# Altium schematic sheet LINE_SENSOR.SchDoc
size A; SheetNumber: 4; SheetTotal: 8
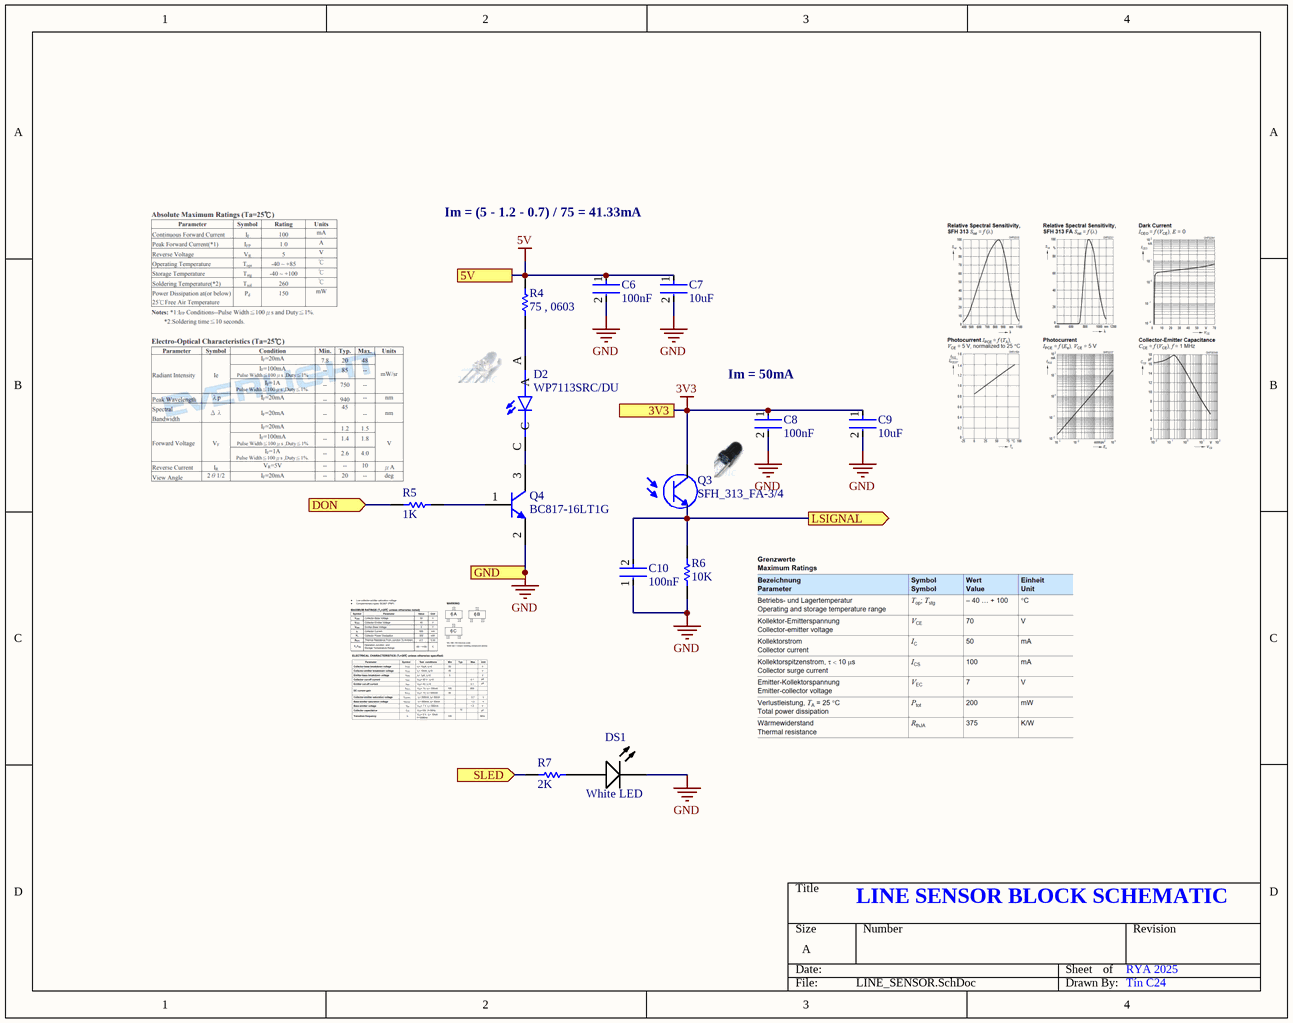
[diagram p0: LINE_SENSOR.SchDoc]

## Parts
C6  100nF  [FP-C0603C-CF-MFG]
C7  10uF  [FP-C0603C-CF-MFG]
C8  100nF  [FP-C0603C-CF-MFG]
C9  10uF  [FP-C0603C-CF-MFG]
C10  100nF  [FP-GRM15-MFG]
D2  WP7113SRC/DU  [IR_LED_NOTBENDED]
DS1  White LED  [AVAG-HSMW-C191_V]
Q3  SFH_313_FA-3/4  [PHOTODIODE_NOTBENDED]
Q4  BC817-16LT1G  [ONSC-SOT-23-3-318-08_V]
R4  75 , 0603  [RESC1608X55X25LL10T15]
R5  1K  [RESC1005X40X25LL05T05]
R6  10K  [RESC1005X40X25LL05T05]
R7  2K  [RESC1005X40X25LL05T05]

## Ports
3V3 (see MAIN_SENSOR[1B], DIS_SENSOR[3B]), 5V (see MAIN_SENSOR[1B], DIS_SENSOR[2B]), DON (in, see MAIN_SENSOR[2B]), GND (see MAIN_SENSOR[1B], DIS_SENSOR[2C]), LSIGNAL (out, see MAIN_SENSOR[2B]), SLED (in, see MAIN_SENSOR[2B])

## Nets
3V3: C8.1 C9.1 Q3.2(C) ; port 3V3
5V: C6.1 C7.1 R4.2 ; port 5V
GND: C6.2 C7.2 C8.2 C9.2 C10.1 DS1.2(K) Q4.2(E) R6.2 ; port GND
DON: R5.2 ; port DON
LSIGNAL: C10.2 Q3.1(E) R6.1 ; port LSIGNAL
SLED: R7.1 ; port SLED
NetD2_A: D2.A R4.1
NetD2_C: D2.C Q4.3(C)
NetDS1_1: DS1.1(A) R7.2
NetQ4_1: Q4.1(B) R5.1

## Notes on the sheet
- Im = (5 - 1.2 - 0.7) / 75 = 41.33mA
- (near C8) Im = 50mA
- LINE SENSOR BLOCK SCHEMATIC
- RYA 2025
- Tín C24

## Library data of the parts
C6-C9 = CMP-1035-00783-3: CAP CER 20PF 50V 5% NP0 0603; Manufacturer Part Number: C0603C200J5GACTU; Manufacturer: KEMET; Temperature Coefficient: 30ppm/°C; Temperature Characteristic: C0G; Automotive Grade: Grade 1; Tolerance: 0.05; Material: Ceramic; Category: Cap; Temperature Range Low: -55°C; RoHS: TRUE; ComponentLink2URL: https://api.kemet.com/component-edge/download/datasheet/C0603C100J5GACAUTO.pdf; Package: C0603C-CF; Height: 0.87mm; Capacitance: 20 pF; Voltage Rating: 50 V; Octopart: https://octopart.com/c0603c200j5gactu-kemet-9138585; Device Class L1: Passive Components; Automotive: Yes; Digikey Description: CAP CER 20PF 50V 5% NP0 0603; Temperature Range High: +125°C; Device Class L3: Ceramic Capacitors; Mouser Description: Multilayer Ceramic Capacitors MLCC - SMD/SMT 50volts 20pF C0G 5%; ComponentLink2Description: Datasheet; Device Class L2: Capacitors; Lead Free: Yes; Temperature: -55°C to +125°C; Value: 20 pF
C10 = CMP-2100-03641-2: CAP CER 0.1UF 16V X7R 0402; Manufacturer Part Number: GRM155R71C104KA88D; Manufacturer: Murata; Standoff Height: 0mm; Tolerance: 10%; Voltage Rating: 16Vdc; Material: Ceramic; Capacitance: 0.10μF; Value: 0.10μF; RoHS: TRUE; Temperature Characteristic: X7R; Octopart: https://octopart.com/grm155r71c104ka88d-murata-196880; Digikey Description: CAP CER 0.1UF 16V X7R 0402; Device Class L3: Ceramic Capacitors; Height: 0.55mm; ComponentLink2Description: Datasheet; Temperature Range Low: -55°C; Ipc Land Pattern Name: CAPC10050X219; ComponentLink2URL: https://search.murata.co.jp/Ceramy/image/img/A01X/G101/ENG/GRM155R71H471KA01-01A.pdf; Device Class L1: Passive Components; Lead Free: yes; Category: Cap; Package: GRM15; Temperature: -55°C to +125°C; Device Class L2: Capacitors; Temperature Range High: +125°C; Mouser Description: 0402 0.1 uF 16V ±10 % Tolerance X7R SMT Multilayer Ceramic Capacitor
D2 = WP7113SRC/DU: Red 640nm LED Indication - Discrete 1.85V Radial; MF: Kingbright; MP: WP7113SRC/DU; Value: *; SnapEDA_Link: https://www.snapeda.com/parts/WP7113SRC/DU/Kingbright/view-part/826988/?ref=snap; Price: None; Package: Radial Kingbright; Availability: Unavailable
DS1 = CMP-007-00016-2: LED Uni-Color White, 78 mW, 20 mA, -40 to 85 degC, 2-Pin SMD, RoHS, Tape and Reel; Manufacturer: Avago; Power: 78mW; Lens Style: Diffused; Luminous Intensity: 200mcd; Forward Voltage: 3.6V; Viewing Angle: 140degrees; Forward Current: 20mA; Illumination Colour: White; Package Quantity: 4000; Mounting Technology: SM; Colour: White; Case/Package: 0603; Package Reference: HSMW-C191; Datasheet Version: May-10; Pins: 2; Package Description: 2-Pin Surface Mount Device, Body 1.6 x 0.8 mm; Min Operating Temperature: -40°C; RoHS Compliant: True; Packaging: TapeandReel; Manufacturer URL: http://www.avagotech.com/; Datasheet URL: http://docs.avagotech.com/docs/AV02-0186EN; Nominal Vf: 3.6V; Max Operating Temperature: 85°C
Q3 = SFH_313_FA-3/4: Phototransistors 870nm Top View Radial - 2 Leads; MF: OSRAM Opto; MP: SFH 313 FA-3/4; Package: Radial-2 Osram Opto; Value: *; Check_prices: https://www.snapeda.com/parts/SFH%20313%20FA-3/4/OSRAM%20Opto%20Semiconductors%20Inc./view-part/240737/?ref=eda; Digi-Key_Part_Number: 475-3328-ND; SnapEDA_Link: https://www.snapeda.com/parts/SFH%20313%20FA-3/4/OSRAM%20Opto%20Semiconductors%20Inc./view-part/240737/?ref=snap
Q4 = CMP-1048-00736-1: General Purpose Transistor, NPN Silicon, 3-Pin SOT-23, Pb-Free, Tape and Reel; Manufacturer: On Semiconductor; IC Continuous (A): 0.5; fT Min (MHz): 100; PartNumber: BC817-16LT1G; Mounting Technology: Surface Mount; PackageVersion: Rev. AP, 11/2009; ComponentLink3Description: Package Specification; PackageReference: SOT-23-3-318-08; Packing: Tape and Reel; ComponentLink1URL: http://www.onsemi.com/; Polarity: NPN; RoHS: TRUE; ComponentLink2URL: http://www.onsemi.com/pub_link/Collateral/BC817-16LT1-D.PDF; ComponentLink3URL: http://www.onsemi.cn/pub_link/Collateral/318-08.PDF; ComponentLink2Description: Datasheet; PackageDescription: 3-Pin Small Outline Transistor, Body 2.92 x 1.3 mm, Pitch 0.95 mm; ComponentLink1Description: Manufacturer URL; DatasheetVersion: Rev. 12
R4 = CMP-2000-06934-1: Thick Film Resistor, 2.2 KOhm, 100 mW, 50 V, +/- 1%, -55 to 155 degC, 2-Pin SMD (0603), RoHS, Tape and Reel; Manufacturer: Yageo; Resistance: 2.2kOhms; Temperature Coefficient: 100PPM/C; Voltage Rating: 50V; Power Rating: 100mW; Tolerance: 1%; Datasheet Version: Rev. 7, 05/2017; Case Code - mm: 1608; Series: RC; Mounting Technology: SurfaceMount; Package Description: 2-Pin Surface Mount Device, Body 1.6 x 0.8 mm; Case Code - in: 0603; Package Reference: 0603; Product: ThickFilmResistorsGeneralPurpose; Manufacturer URL: http://www.yageo.com/; Termination Style: SMD/SMT; Operating Temperature Range: -55Cto+155C; Datasheet URL: http://www.yageo.com/documents/recent/PYu-RC_Group_51_RoHS_L_7.pdf; Packaging: Reel
R5 = CMP-2000-07451-1: 0402 , 1KOhm; Manufacturer: Panasonic; Voltage Rating (DC): 50V; Temperature Coefficient: 600ppm/��C; Max Power Dissipation: 100mW; Resistance: 0mOhm; Tolerance: 5%; Number of Terminations: 2; Mount: SurfaceMount; Height: 0.35mm; Packaging: TapeandReel; Contact Plating: Tin; Manufacturer URL: http://www.panasonic.com/; Composition: ThickFilm; Max Operating Temperature: 155degC; REACH SVHC: NoSVHC; Case/Package: 0402; Package Reference: 402; Depth: 0.5mm; Package Description: 2-Pin Surface Mount Device, Body 1 x 0.5 mm; Datasheet URL: https://industrial.panasonic.com/cdbs/www-data/pdf/RDA0000/AOA0000C301.pdf; RoHSCompliant: True; Case Code (Imperial): 0402; Military Standard: Not; Min Operating Temperature: -55degC; Power Rating: 100mW; Datasheet Version: 03/2015; Length: 1mm; Case Code (Metric): 1005; Termination: SMD/SMT; Mounting Technology: SurfaceMount; Voltage Rating: 50V; Width: 0.02inch; Package Quantity: 1; Lead Free: LeadFree; Radiation Hardening: No
R6 R7 = CMP-2000-07451-1: Chip Resistor, 0 Ohm, 0.1 W, -55 to 155 degC, 0402 (1005 Metric), RoHS, Tape and Reel; Manufacturer: Panasonic; Voltage Rating (DC): 50V; Temperature Coefficient: 600ppm/��C; Max Power Dissipation: 100mW; Resistance: 0mOhm; Tolerance: 5%; Number of Terminations: 2; Mount: SurfaceMount; Height: 0.35mm; Packaging: TapeandReel; Contact Plating: Tin; Manufacturer URL: http://www.panasonic.com/; Composition: ThickFilm; Max Operating Temperature: 155degC; REACH SVHC: NoSVHC; Case/Package: 0402; Package Reference: 402; Depth: 0.5mm; Package Description: 2-Pin Surface Mount Device, Body 1 x 0.5 mm; Datasheet URL: https://industrial.panasonic.com/cdbs/www-data/pdf/RDA0000/AOA0000C301.pdf; RoHSCompliant: True; Case Code (Imperial): 0402; Military Standard: Not; Min Operating Temperature: -55degC; Power Rating: 100mW; Datasheet Version: 03/2015; Length: 1mm; Case Code (Metric): 1005; Termination: SMD/SMT; Mounting Technology: SurfaceMount; Voltage Rating: 50V; Width: 0.02inch; Package Quantity: 1; Lead Free: LeadFree; Radiation Hardening: No